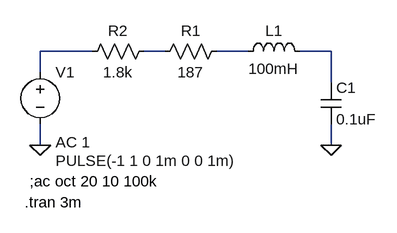
[diagram p0: schematic RLC_LPF 100mH.asc]
RLC_LPF 100mH.asc, the LTspice schematic file:
Version 4
SHEET 1 880 680
WIRE 208 80 128 80
WIRE 320 80 288 80
WIRE 448 80 400 80
WIRE 576 80 528 80
WIRE 128 112 128 80
WIRE 576 128 576 80
WIRE 128 224 128 192
WIRE 576 224 576 192
FLAG 576 224 0
FLAG 128 224 0
SYMBOL voltage 128 96 R0
WINDOW 3 24 152 Left 2
WINDOW 123 24 124 Left 2
WINDOW 39 0 0 Left 2
SYMATTR Value PULSE(-1 1 0 1m 0 0 1m)
SYMATTR Value2 AC 1
SYMATTR InstName V1
SYMBOL res 416 64 R90
WINDOW 0 0 56 VBottom 2
WINDOW 3 32 56 VTop 2
SYMATTR InstName R1
SYMATTR Value 187
SYMBOL ind 432 96 R270
WINDOW 0 32 56 VTop 2
WINDOW 3 5 56 VBottom 2
SYMATTR InstName L1
SYMATTR Value 100mH
SYMBOL cap 560 128 R0
SYMATTR InstName C1
SYMATTR Value 0.1uF
SYMBOL res 304 64 R90
WINDOW 0 0 56 VBottom 2
WINDOW 3 32 56 VTop 2
SYMATTR InstName R2
SYMATTR Value 1.8k
TEXT 112 280 Left 2 !;ac oct 20 10 100k
TEXT 104 312 Left 2 !.tran 3m

The netlist it stands for:
* RLC_LPF 100mH.asc
V1 N001 0 PULSE(-1 1 0 1m 0 0 1m) AC 1
R1 N003 N002 187
L1 N003 N004 100mH
C1 N004 0 0.1uF
R2 N002 N001 1.8k
;ac oct 20 10 100k
.tran 3m
.backanno
.end